# Altium schematic sheet power.SchDoc: power
size 420 x 297 mm; Date: 2021-12-08; Author: Joachim Löfwander; Revision: AAA-000; SheetNumber: 2; SheetTotal: 4; Website: github.com/jlofw
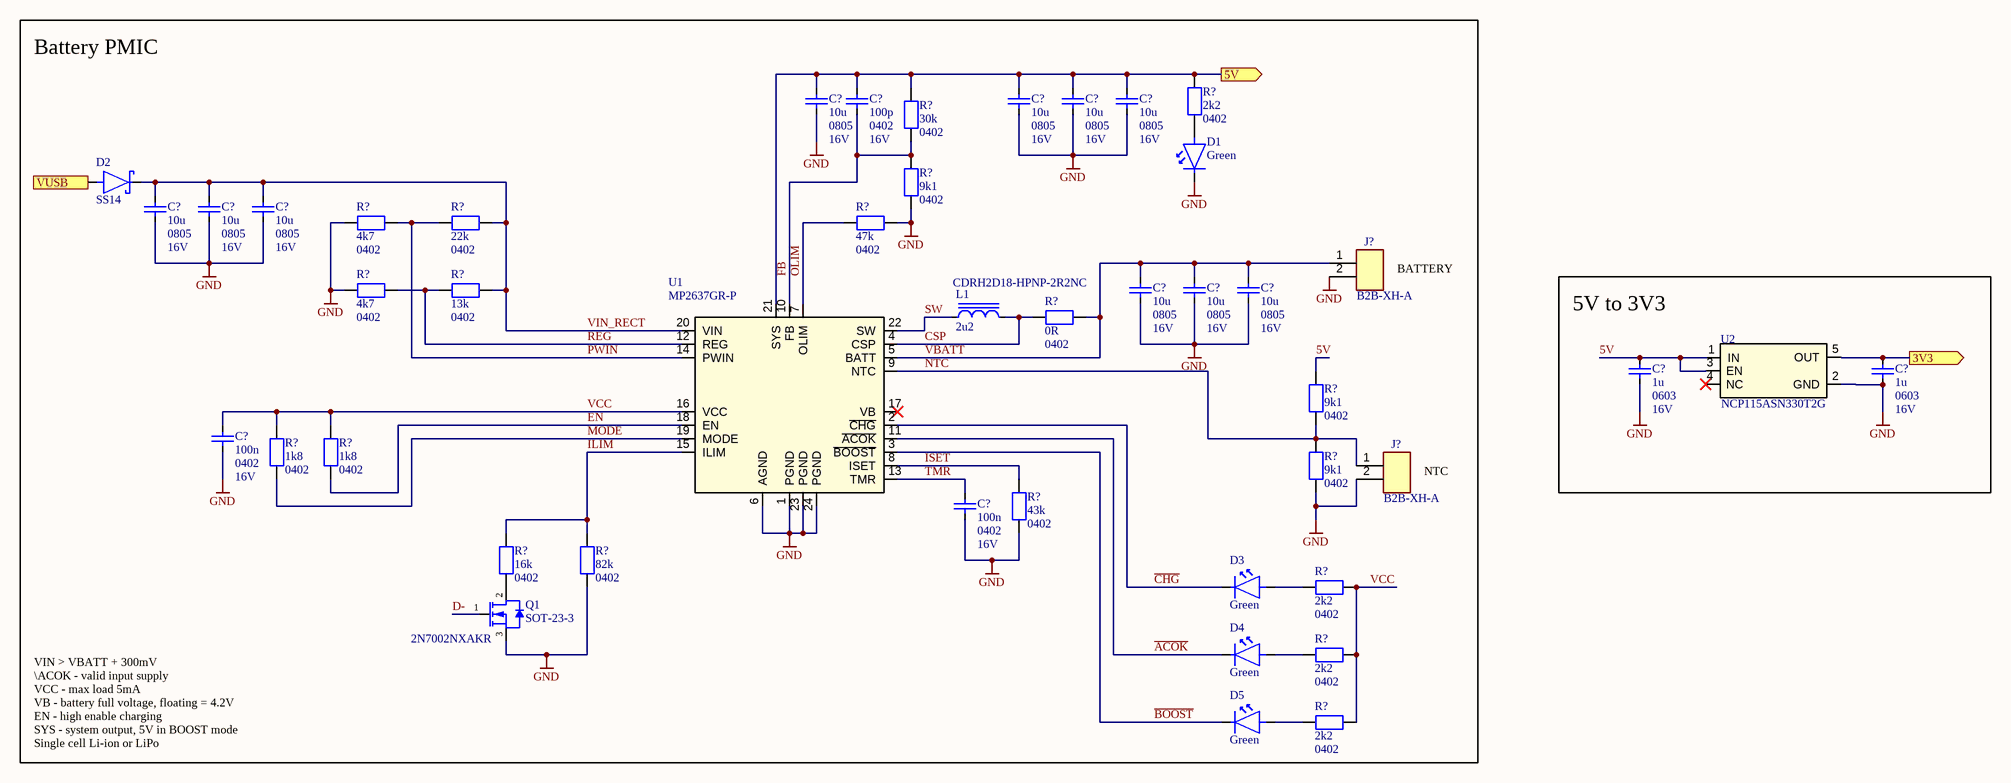
[diagram p0: power.SchDoc]

## Parts
(Parts that share a designator on the sheet are numbered #1, #2 ... from top to bottom, then left to right.)
C?#1  value 10u  Package: 0805  Voltage: 16V  [C_0805_2012Metric_IPCB]  (hidden comment: capacitor_ceramic)
C?#2  value 100p  Package: 0402  Voltage: 16V  [C_0402_1005Metric_IPCB]  (hidden comment: capacitor_ceramic)
C?#3  value 10u  Package: 0805  Voltage: 16V  [C_0805_2012Metric_IPCB]  (hidden comment: capacitor_ceramic)
C?#4  value 10u  Package: 0805  Voltage: 16V  [C_0805_2012Metric_IPCB]  (hidden comment: capacitor_ceramic)
C?#5  value 10u  Package: 0805  Voltage: 16V  [C_0805_2012Metric_IPCB]  (hidden comment: capacitor_ceramic)
C?#6  value 10u  Package: 0805  Voltage: 16V  [C_0805_2012Metric_IPCB]  (hidden comment: capacitor_ceramic)
C?#7  value 10u  Package: 0805  Voltage: 16V  [C_0805_2012Metric_IPCB]  (hidden comment: capacitor_ceramic)
C?#8  value 10u  Package: 0805  Voltage: 16V  [C_0805_2012Metric_IPCB]  (hidden comment: capacitor_ceramic)
C?#9  value 10u  Package: 0805  Voltage: 16V  [C_0805_2012Metric_IPCB]  (hidden comment: capacitor_ceramic)
C?#10  value 10u  Package: 0805  Voltage: 16V  [C_0805_2012Metric_IPCB]  (hidden comment: capacitor_ceramic)
C?#11  value 10u  Package: 0805  Voltage: 16V  [C_0805_2012Metric_IPCB]  (hidden comment: capacitor_ceramic)
C?#12  value 1u  Package: 0603  Voltage: 16V  [C_0603_1608Metric_IPCB]  (hidden comment: capacitor_ceramic)
C?#13  value 1u  Package: 0603  Voltage: 16V  [C_0603_1608Metric_IPCB]  (hidden comment: capacitor_ceramic)
C?#14  value 100n  Package: 0402  Voltage: 16V  [C_0402_1005Metric_IPCB]  (hidden comment: capacitor_ceramic)
C?#15  value 100n  Package: 0402  Voltage: 16V  [C_0402_1005Metric_IPCB]  (hidden comment: capacitor_ceramic)
D1  value Green  [LED_0402]  (hidden comment: diode_LED)
D2  Manufacturer P/N: SS14  [D_SMA_IPCB]  (hidden comment: diode_schottky)
D3  value Green  [LED_0402]  (hidden comment: diode_LED)
D4  value Green  [LED_0402]  (hidden comment: diode_LED)
D5  value Green  [LED_0402]  (hidden comment: diode_LED)
J?#1  Manufacturer P/N: B2B-XH-A  [JST_XH_B2B-XH-A]  (hidden comment: conn_01x02)
J?#2  Manufacturer P/N: B2B-XH-A  [JST_XH_B2B-XH-A]  (hidden comment: conn_01x02)
L1  value 2u2  Manufacturer P/N: CDRH2D18-HPNP-2R2NC  [Sumida_CDRH2D18-HPNP-2R2NC]  (hidden comment: inductor)
Q1  Package: SOT-23-3  Manufacturer P/N: 2N7002NXAKR  [SOT23-3_Standard_IPCB]  (hidden comment: NMOS_GDS)
R?#1  value 2k2  Package: 0402  [R_0402_1005Metric_IPCB]  (hidden comment: resistor)
R?#2  value 30k  Package: 0402  [R_0402_1005Metric_IPCB]  (hidden comment: resistor)
R?#3  value 9k1  Package: 0402  [R_0402_1005Metric_IPCB]  (hidden comment: resistor)
R?#4  value 4k7  Package: 0402  [R_0402_1005Metric_IPCB]  (hidden comment: resistor)
R?#5  value 22k  Package: 0402  [R_0402_1005Metric_IPCB]  (hidden comment: resistor)
R?#6  value 47k  Package: 0402  [R_0402_1005Metric_IPCB]  (hidden comment: resistor)
R?#7  value 4k7  Package: 0402  [R_0402_1005Metric_IPCB]  (hidden comment: resistor)
R?#8  value 13k  Package: 0402  [R_0402_1005Metric_IPCB]  (hidden comment: resistor)
R?#9  value 0R  Package: 0402  [R_0402_1005Metric_IPCB]  (hidden comment: resistor)
R?#10  value 9k1  Package: 0402  [R_0402_1005Metric_IPCB]  (hidden comment: resistor)
R?#11  value 1k8  Package: 0402  [R_0402_1005Metric_IPCB]  (hidden comment: resistor)
R?#12  value 1k8  Package: 0402  [R_0402_1005Metric_IPCB]  (hidden comment: resistor)
R?#13  value 9k1  Package: 0402  [R_0402_1005Metric_IPCB]  (hidden comment: resistor)
R?#14  value 43k  Package: 0402  [R_0402_1005Metric_IPCB]  (hidden comment: resistor)
R?#15  value 16k  Package: 0402  [R_0402_1005Metric_IPCB]  (hidden comment: resistor)
R?#16  value 82k  Package: 0402  [R_0402_1005Metric_IPCB]  (hidden comment: resistor)
R?#17  value 2k2  Package: 0402  [R_0402_1005Metric_IPCB]  (hidden comment: resistor)
R?#18  value 2k2  Package: 0402  [R_0402_1005Metric_IPCB]  (hidden comment: resistor)
R?#19  value 2k2  Package: 0402  [R_0402_1005Metric_IPCB]  (hidden comment: resistor)
U1  Manufacturer P/N: MP2637GR-P  [MP2637GR]  (hidden comment: MP2637GR)
U2  NCP115ASN330T2G  [NCP115ASN330T2G]

## Blocks framed on the sheet
Battery PMIC: C?#1-C?#11 C?#14 C?#15 D1-D5 J?#1 J?#2 L1 Q1 R?#1-R?#19 U1
5V to 3V3: C?#12 C?#13 U2

## Ports
3V3 (out), 5V (out), VUSB (in)

## Nets
GND: C?#1.1 C?#3.1 C?#4.1 C?#5.1 C?#6.1 C?#7.1 C?#8.1 C?#9.1 C?#10.1 C?#11.1 C?#12.1 C?#13.1 C?#14.1 C?#15.1 D1.1(C) J?#1.2 J?#2.2 Q1.3(SOURCE) R?#3.1 R?#4.1 R?#6.2 R?#7.1 R?#13.1 R?#14.1 R?#16.1 U1.1(PGND) U1.6(AGND) U1.23(PGND) U1.24(PGND) U2.2(GND)
3V3: C?#13.2 U2.5(OUT) ; port 3V3
5V: C?#1.2 C?#2.2 C?#3.2 C?#4.2 C?#5.2 R?#1.2 R?#2.2 U1.21(SYS) ; port 5V
5V: C?#12.2 R?#10.2 U2.1(IN) U2.3(EN)  [a separate net that carries the same name]
~{ACOK}: D4.1(C) U1.11(~{ACOK})
~{BOOST}: D5.1(C) U1.3(~{BOOST})
~{CHG}: D3.1(C) U1.2(~{CHG})
CSP: L1.2 R?#9.1 U1.4(CSP)
D-: Q1.1(GATE)
EN: R?#12.1 U1.18(EN)
FB: C?#2.1 R?#2.1 R?#3.2 U1.10(FB)
ILIM: R?#15.2 R?#16.2 U1.15(ILIM)
ISET: R?#14.2 U1.8(ISET)
MODE: R?#11.1 U1.19(MODE)
NTC: J?#2.1 R?#10.1 R?#13.2 U1.9(NTC)
OLIM: R?#6.1 U1.7(OLIM)
PWIN: R?#4.2 R?#5.1 U1.14(PWIN)
REG: R?#7.2 R?#8.1 U1.12(REG)
SW: L1.1 U1.22(SW)
TMR: C?#15.2 U1.13(TMR)
VBATT: C?#9.2 C?#10.2 C?#11.2 J?#1.1 R?#9.2 U1.5(BATT)
VCC: C?#14.2 R?#11.2 R?#12.2 R?#17.2 R?#18.2 R?#19.2 U1.16(VCC)
VIN_RECT: C?#6.2 C?#7.2 C?#8.2 D2.1(C) R?#5.2 R?#8.2 U1.20(VIN)
VUSB: D2.2(A) ; port VUSB
NetD1_2: D1.2(A) R?#1.1
NetD3_2: D3.2(A) R?#17.1
NetD4_2: D4.2(A) R?#18.1
NetD5_2: D5.2(A) R?#19.1
NetQ1_2: Q1.2(DRAIN) R?#15.1

Not connected (* = marked no-connect by the designer): U1 17(VB)*; U2 4(NC)*

## Notes on the sheet
- (near J?#1) BATTERY
- (near J?#2) NTC
- VIN > VBATT + 300mV
  \ACOK - valid input supply
  VCC - max load 5mA
  VB - battery full voltage, floating = 4.2V
  EN - high enable charging
  SYS - system output, 5V in BOOST mode
  Single cell Li-ion or LiPo
- PROJECT
- TITLE
- FILE NAME
- DATE MODIFIED
- SHEET
- REV
- OF
- AUTHOR
- WEBSITE

## Library data of the parts
C?#1 C?#3-C?#11 = 20174: 16V 0805; Internal Number: 20174
C?#2 = 20007: 16V 0402; Internal Number: 20007
C?#12 C?#13 = 20100: 16V 0603; Internal Number: 20100
C?#14 C?#15 = 20025: 16V 0402; Internal Number: 20025
D1 D3-D5 = 40002: LED 0402 Green; Internal Number: 40002; Package: 0402
D2 = 40006: Schottky 40 V 1A SMA; Manufacturer: onsemi; Internal Number: 40006; Package: SMA
J?#1 J?#2 = 110010: JST XH Vertical TH 2p; Internal Number: 110010; Manufacturer: JST
L1 = 190001: Inductor 2.2uH 1.6A 60mOhm; Manufacturer: Sumida; Internal Number: 190001
Q1 = 60001: 60V 300mA NMOS SOT-23-3; Manufacturer: Nexperia; Internal Number: 60001
R?#1 R?#17-R?#19 = 10082: 0402 1%; Internal Number: 10082
R?#2 = 10109: 0402 1%; Internal Number: 10109
R?#3 R?#10 R?#13 = 10097: 0402 1%; Internal Number: 10097
R?#4 R?#7 = 10090: 0402 1%; Internal Number: 10090
R?#5 = 10106: 0402 1%; Internal Number: 10106
R?#6 = 10114: 0402 1%; Internal Number: 10114
R?#8 = 10101: 0402 1%; Internal Number: 10101
R?#9 = 10001: 0402 1%; Internal Number: 10001
R?#11 R?#12 = 10080: 0402 1%; Internal Number: 10080
R?#14 = 10113: 0402 1%; Internal Number: 10113
R?#15 = 10103: 0402 1%; Internal Number: 10103
R?#16 = 10120: 0402 1%; Internal Number: 10120
U1 = 180003: MP2637GR Li-ion charger; Manufacturer: Monolithic Power Systems; Internal Number: 180003; Package: QFN
U2 = 80001: 3V3 LDO 300mA; Manufacturer: onsemi; Internal Number: 80001; Manufacturer P/N: NCP115ASN330T2G; Package: TSOP5